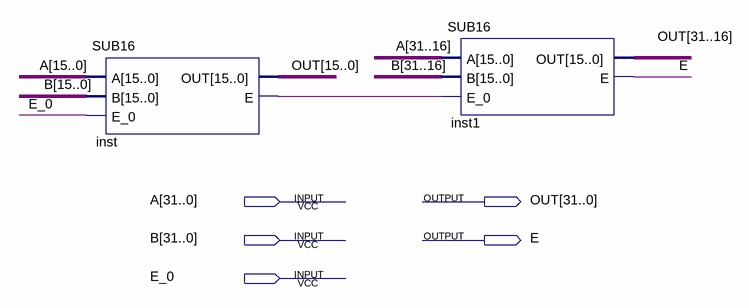
[diagram p0: schematic sheet]
// Quartus schematic SUB32.bdf as structural Verilog: 2 symbols, 5 pins
module SUB32 (
  input  [31:0] A,
  input  [31:0] B,
  input  E_0,
  output [31:0] OUT,
  output E
);

  wire inst_e;

  SUB16 inst (.A(A[15:0]), .B(B[15:0]), .E_0(E_0), .OUT(OUT[15:0]), .E(inst_e));
  SUB16 inst1 (.A(A[31:16]), .B(B[31:16]), .E_0(inst_e), .OUT(OUT[31:16]), .E(E));
endmodule
